# Altium schematic sheet MotherBoard1.SchDoc
size A3
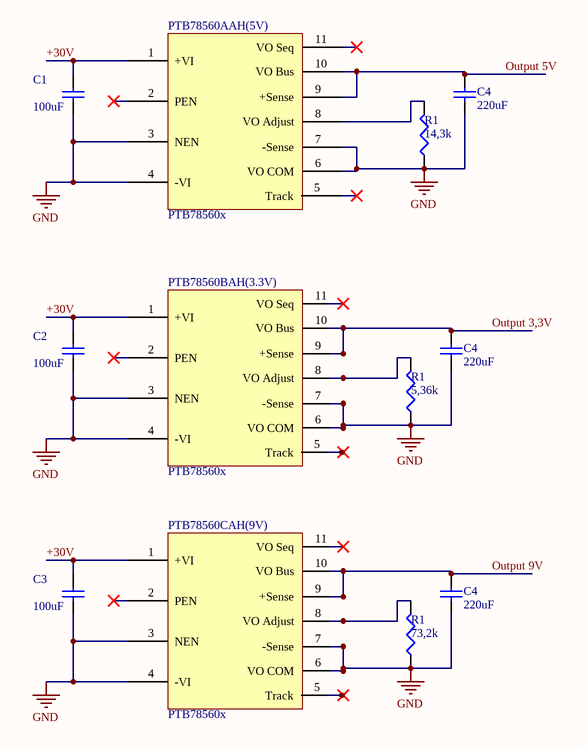
[diagram p0: MotherBoard1.SchDoc]

## Parts
(Parts that share a designator on the sheet are numbered #1, #2 ... from top to bottom, then left to right.)
C1  value 100uF  [C0805C]  (hidden comment: CAP)
C2  value 100uF  [C0805C]  (hidden comment: CAP)
C3  value 100uF  [C0805C]  (hidden comment: CAP)
C4#1  value 220uF  [C0805C]  (hidden comment: CAP)
C4#2  value 220uF  [C0805C]  (hidden comment: CAP)
C4#3  value 220uF  [C0805C]  (hidden comment: CAP)
PTB78560AAH(5V)  PTB78560x  [PTB78560x]
PTB78560BAH(3.3V)  PTB78560x  [PTB78560x]
PTB78560CAH(9V)  PTB78560x  [PTB78560x]
R1#1  value 14,3k  [C0805R]  (hidden comment: RES)
R1#2  value 5,36k  [C0805R]  (hidden comment: RES)
R1#3  value 73,2k  [C0805R]  (hidden comment: RES)

## Nets
GND: C1.1 C2.1 C3.1 C4#1.2 C4#2.2 C4#3.2 PTB78560AAH(5V).3(NEN) PTB78560AAH(5V).4(-VI) PTB78560AAH(5V).6(VO_COM) PTB78560AAH(5V).7(-Sense) PTB78560BAH(3.3V).3(NEN) PTB78560BAH(3.3V).4(-VI) PTB78560BAH(3.3V).6(VO_COM) PTB78560BAH(3.3V).7(-Sense) PTB78560CAH(9V).3(NEN) PTB78560CAH(9V).4(-VI) PTB78560CAH(9V).6(VO_COM) PTB78560CAH(9V).7(-Sense) R1#1.1 R1#2.1 R1#3.1
+30V: C1.2 C2.2 C3.2 PTB78560AAH(5V).1(+VI) PTB78560BAH(3.3V).1(+VI) PTB78560CAH(9V).1(+VI)
Output 3,3V: C4#2.1 PTB78560BAH(3.3V).9(+Sense) PTB78560BAH(3.3V).10(VO_Bus)
Output 5V: C4#1.1 PTB78560AAH(5V).9(+Sense) PTB78560AAH(5V).10(VO_Bus)
Output 9V: C4#3.1 PTB78560CAH(9V).9(+Sense) PTB78560CAH(9V).10(VO_Bus)
NetPTB78560AAH(5V)_8: PTB78560AAH(5V).8(VO_Adjust) R1#1.2
NetPTB78560BAH(3.3V)_8: PTB78560BAH(3.3V).8(VO_Adjust) R1#2.2
NetPTB78560CAH(9V)_8: PTB78560CAH(9V).8(VO_Adjust) R1#3.2

Not connected (* = marked no-connect by the designer): PTB78560AAH(5V) 2(PEN)* 5(Track)* 11(VO_Seq)*; PTB78560BAH(3.3V) 2(PEN)* 5(Track)* 11(VO_Seq)*; PTB78560CAH(9V) 2(PEN)* 5(Track)* 11(VO_Seq)*

## Library data of the parts
C1-C3 C4#1-C4#3 = CAP: Capacitor; Published: 8-Jun-2000; LatestRevisionDate: 29-May-2009; LatestRevisionNote: IPC-7351 Footprint Added.; PackageReference: C1206; Publisher: Altium Limited; PackageDescription: Chip Capacitor
PTB78560AAH(5V) PTB78560BAH(3.3V) PTB78560CAH(9V) = PTB78560x: PTB78560x Texas Instruments Regulator
R1#1-R1#3 = RES: Resistor; Published: 8-Jun-2000; LatestRevisionDate: 29-May-2009; LatestRevisionNote: IPC-7351 Footprint Added.; PackageReference: J1-0603; Publisher: Altium Limited; PackageDescription: Chip Resistor